# Altium schematic sheet Load_Cells_SCH.SchDoc
size A
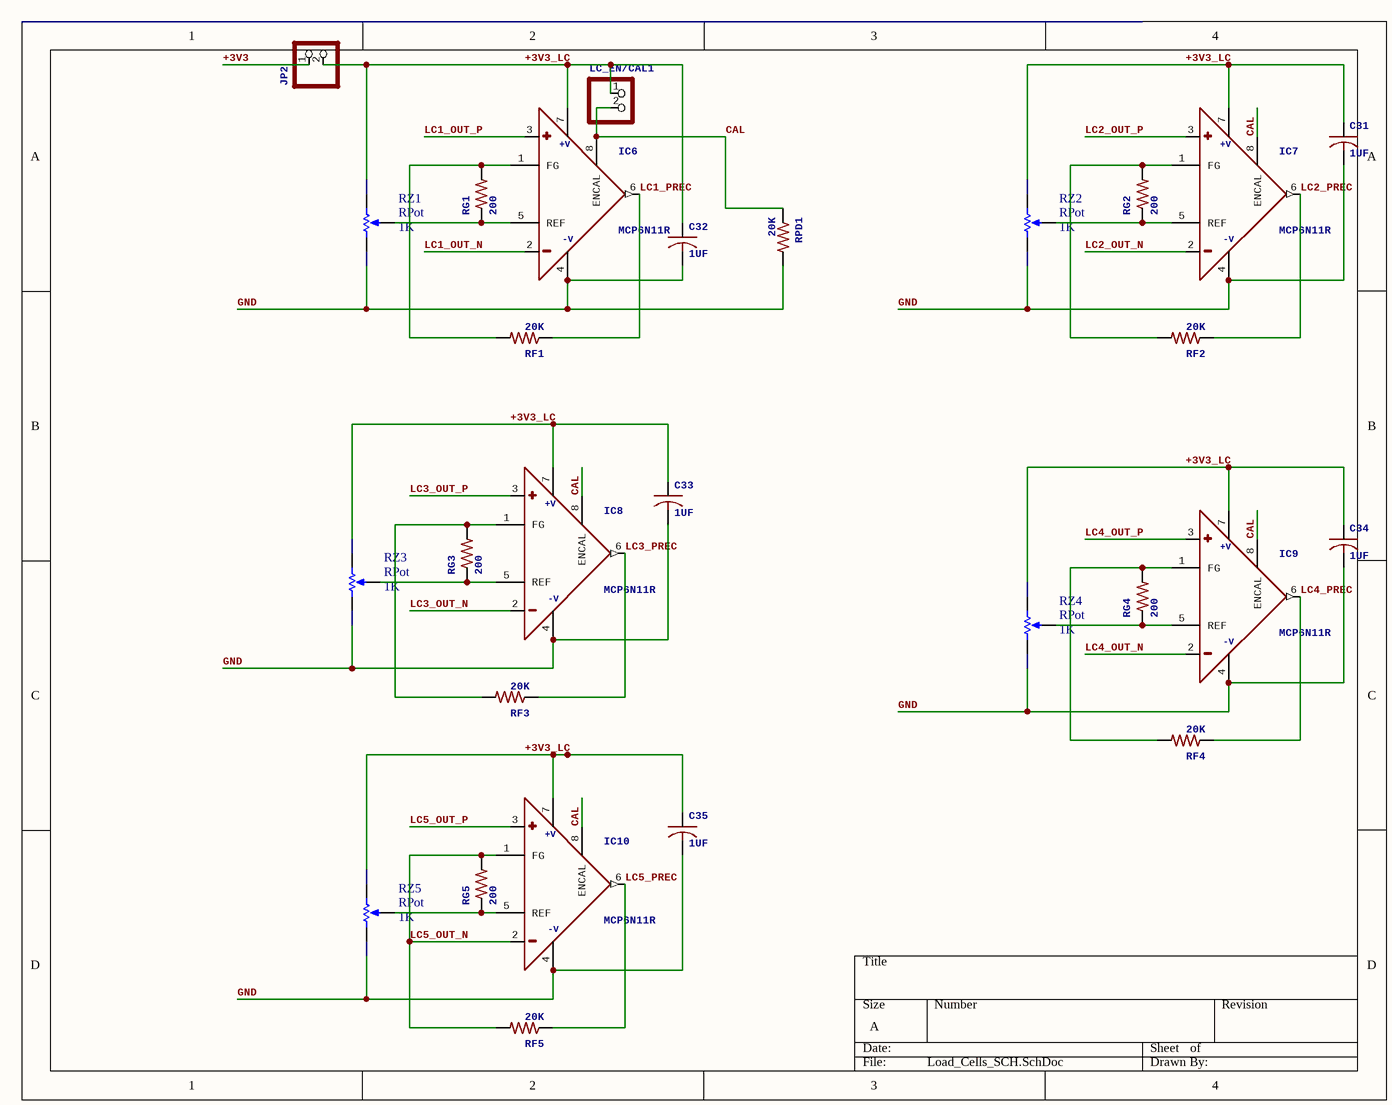
[diagram p0: Load_Cells_SCH.SchDoc]

## Parts
C31  1UF  [CAPCP2012X06N]
C32  1UF  [CAPCP2012X06N]
C33  1UF  [CAPCP2012X06N]
C34  1UF  [CAPCP2012X06N]
C35  1UF  [CAPCP2012X06N]
IC6  MCP6N11R  [SOIC127P1030X265-8N]
IC7  MCP6N11R  [SOIC127P1030X265-8N]
IC8  MCP6N11R  [SOIC127P1030X265-8N]
IC9  MCP6N11R  [SOIC127P1030X265-8N]
IC10  MCP6N11R  [SOIC127P1030X265-8N]
JP2  PINHD-1X2  [MHDR1X2]  (value not drawn)
LC_EN/CAL1  PINHD-1X2  [MHDR1X2]  (value not drawn)
RF1  20K  [RESC_0805_2012]
RF2  20K  [RESC_0805_2012]
RF3  20K  [RESC_0805_2012]
RF4  20K  [RESC_0805_2012]
RF5  20K  [RESC_0805_2012]
RG1  200  [RESC_0805_2012]
RG2  200  [RESC_0805_2012]
RG3  200  [RESC_0805_2012]
RG4  200  [RESC_0805_2012]
RG5  200  [RESC_0805_2012]
RPD1  20K  [RESC_0805_2012]
RZ1  RPot  value 1K  [VR5]
RZ2  RPot  value 1K  [VR5]
RZ3  RPot  value 1K  [VR5]
RZ4  RPot  value 1K  [VR5]
RZ5  RPot  value 1K  [VR5]

## Nets
+3V3: JP2.1
+3V3_LC: C31.1 C32.1 C33.1 C34.1 C35.1 IC6.7(+V) IC7.7(+V) IC8.7(+V) IC9.7(+V) IC10.7(+V) JP2.2 LC_EN/CAL1.1 RZ1.2(BOT) RZ2.2(BOT) RZ3.2(BOT) RZ4.2(BOT) RZ5.2(BOT)
CAL: IC6.8(ENCAL) IC7.8(ENCAL) IC8.8(ENCAL) IC9.8(ENCAL) IC10.8(ENCAL) LC_EN/CAL1.2 RPD1.1
GND: C31.2 C32.2 C33.2 C34.2 C35.2 IC6.4(-V) IC7.4(-V) IC8.4(-V) IC9.4(-V) IC10.4(-V) RPD1.2 RZ1.1(TOP) RZ2.1(TOP) RZ3.1(TOP) RZ4.1(TOP) RZ5.1(TOP)
LC1_OUT_N: IC6.2(-)
LC1_OUT_P: IC6.3(+)
LC1_PREC: IC6.6(OUT) RF1.1
LC2_OUT_N: IC7.2(-)
LC2_OUT_P: IC7.3(+)
LC2_PREC: IC7.6(OUT) RF2.1
LC3_OUT_N: IC8.2(-)
LC3_OUT_P: IC8.3(+)
LC3_PREC: IC8.6(OUT) RF3.1
LC4_OUT_N: IC9.2(-)
LC4_OUT_P: IC9.3(+)
LC4_PREC: IC9.6(OUT) RF4.1
LC5_OUT_N: IC10.1(FG) IC10.2(-) RF5.2 RG5.2
LC5_OUT_P: IC10.3(+)
LC5_PREC: IC10.6(OUT) RF5.1
NetIC6_1: IC6.1(FG) RF1.2 RG1.2
NetIC6_5: IC6.5(REF) RG1.1 RZ1.3(TAP)
NetIC7_1: IC7.1(FG) RF2.2 RG2.2
NetIC7_5: IC7.5(REF) RG2.1 RZ2.3(TAP)
NetIC8_1: IC8.1(FG) RF3.2 RG3.2
NetIC8_5: IC8.5(REF) RG3.1 RZ3.3(TAP)
NetIC9_1: IC9.1(FG) RF4.2 RG4.2
NetIC9_5: IC9.5(REF) RG4.1 RZ4.3(TAP)
NetIC10_5: IC10.5(REF) RG5.1 RZ5.3(TAP)

## Library data of the parts
C31-C35 = C-USC0805: CAPACITOR, American symbol; GateName_1: G$1; SymbolName_1: C-US; DeviceName: C0805; LibraryName: rcl; DeviceSetName: C-US; SPICEPREFIX: C
IC6-IC10 = MCP6N11R: Low Cost, Low Power, Instrumentation AmplifierSource: http://www.analog.com/UploadedFiles/Data_Sheets/37793330023930AD620_e.pdf; MPN: AD620AR; GateName_1: G$1; DeviceName: R; SymbolName_1: MCP6N11; LibraryName: microchip-extra; DeviceSetName: MCP6N11; MF: *; OC_FARNELL: 1464424; OC_NEWARK: 05F7109; +V: +V; -V: -V
JP2 LC_EN/CAL1 = PINHD-1X2: PIN HEADER; GateName_1: G$1; SymbolName_1: PINHD2; LibraryName: pinhead; DeviceSetName: PINHD-1X2
RF1-RF5 RG1-RG5 RPD1 = R-US_R0805: RESISTOR, American symbol; GateName_1: G$1; SymbolName_1: R-US; DeviceName: R0805; DeviceSetName: R-US_; LibraryName: rcl
RZ1-RZ5 = RPot: Potentiometer; Sim Note: Enter the Resistance value and the set point into parameter fields.; Set Position: 0.5; Published: 8-Jun-2000; LatestRevisionDate: 17-Jul-2002; LatestRevisionNote: Re-released for DXP Platform.; PackageReference: VR5; Publisher: Altium Limited; PackageDescription: Variable Resistor, Thru-Hole; 3 Leads